# EAGLE design untitled (EAGLE 5.11)
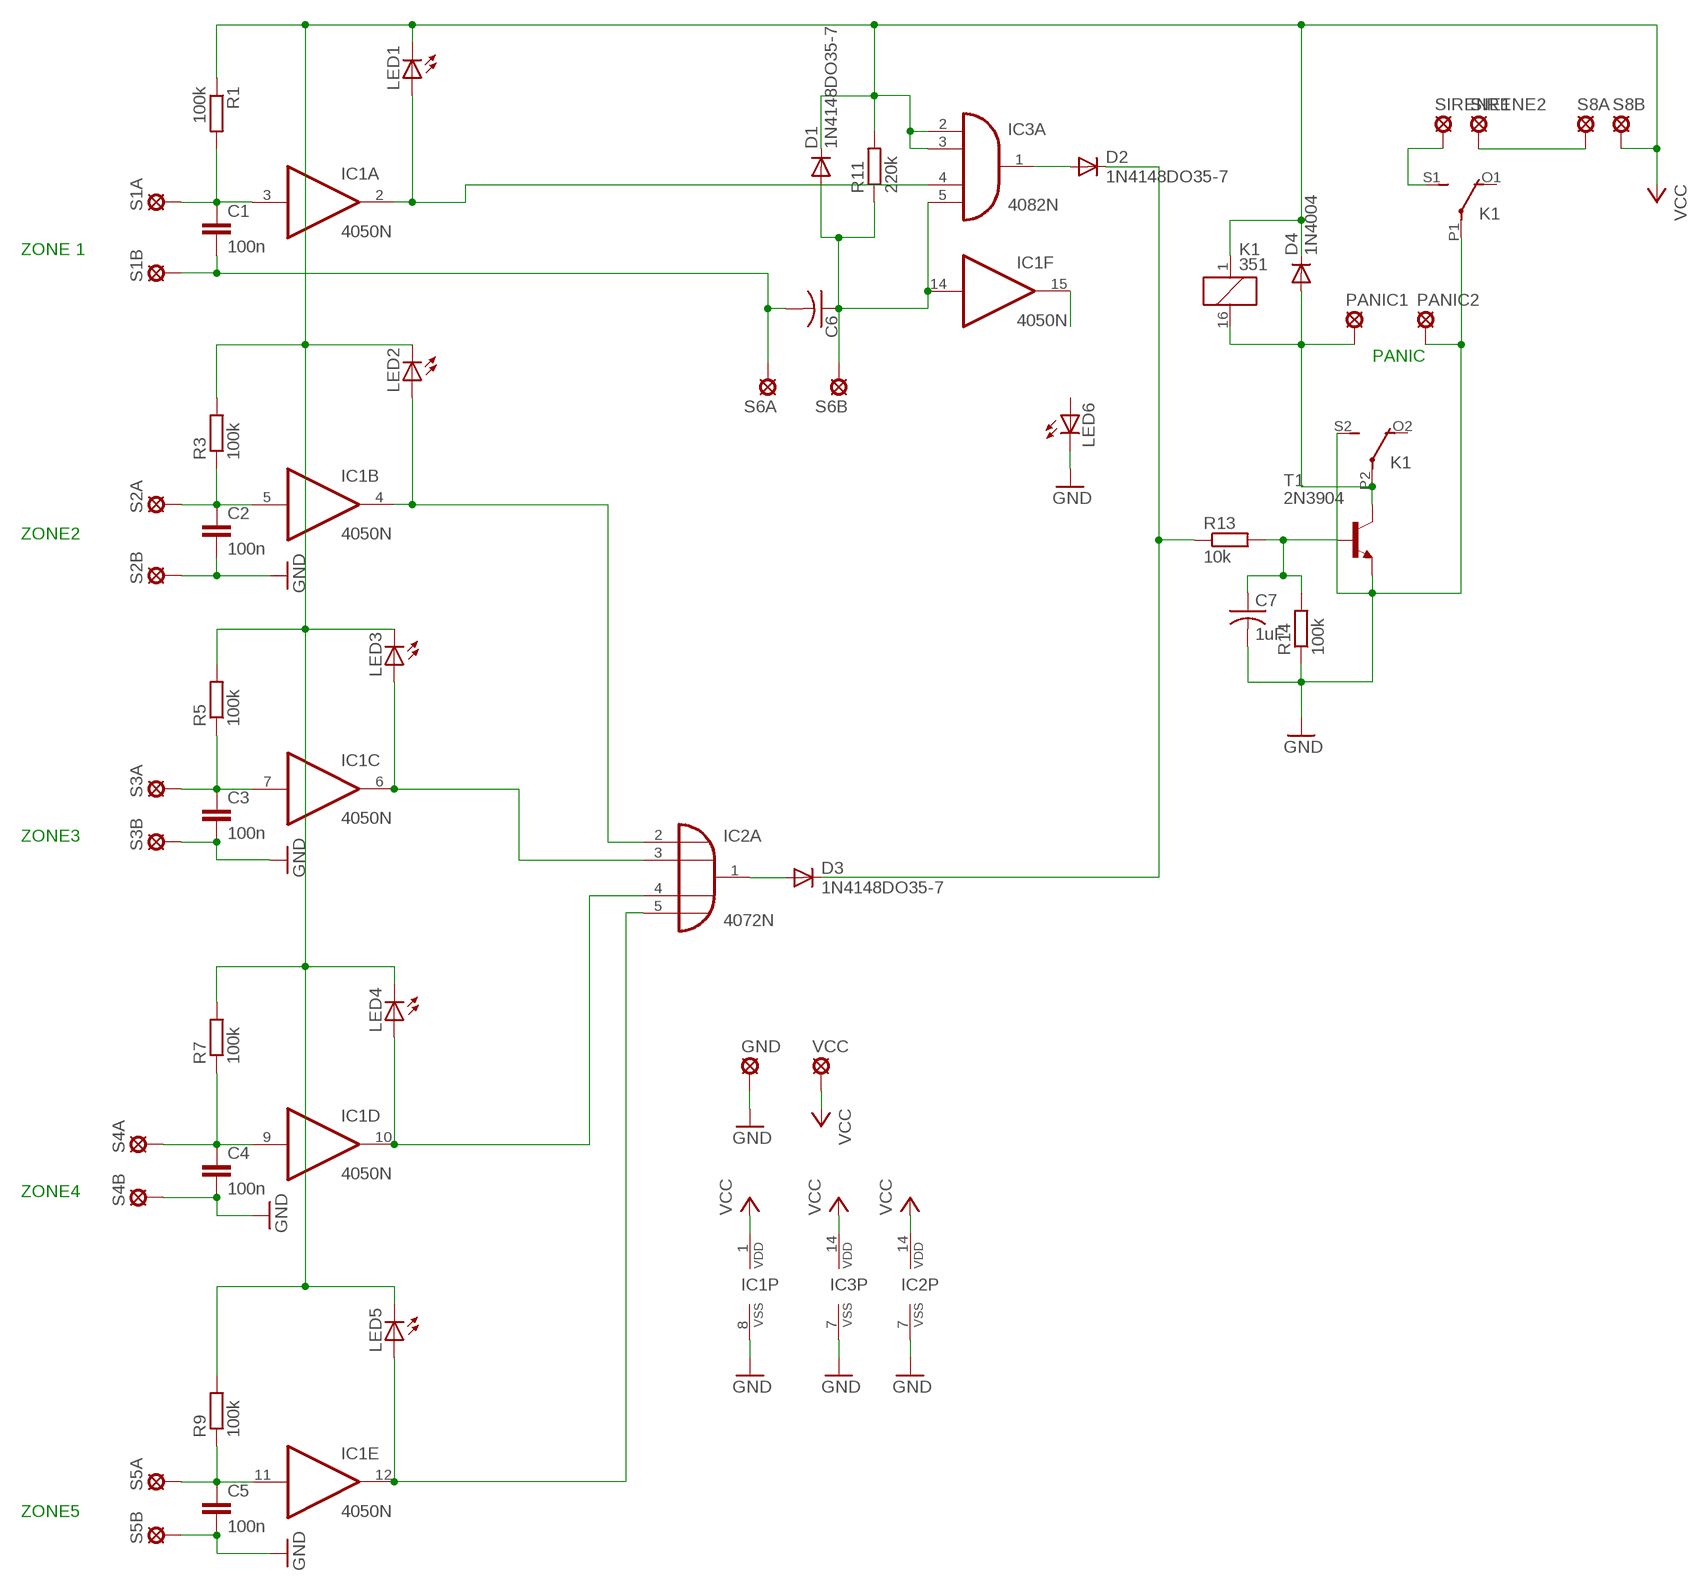
[diagram p0: schematic, sheet 1]

## Parts
C1  100n  C-EU025-024X044  [C025-024X044]
C2  100n  C-EU025-024X044  [C025-024X044]
C3  100n  C-EU025-024X044  [C025-024X044]
C4  100n  C-EU025-024X044  [C025-024X044]
C5  100n  C-EU025-024X044  [C025-024X044]
C6  C-US025-024X044  [C025-024X044]
C7  1uF  C-US025-024X044  [C025-024X044]
D1  1N4148DO35-7  [DO35-7]
D2  1N4148DO35-7  [DO35-7]
D3  1N4148DO35-7  [DO35-7]
D4  1N4004  [DO41-10]
GND  LSP11  [LSP11]
IC1  4050N  [DIL16]
IC2  4072N  [DIL14]
IC3  4082N  [DIL14]
K1  351  [351]
LED1  LED5MM  [LED5MM]
LED2  LED5MM  [LED5MM]
LED3  LED5MM  [LED5MM]
LED4  LED5MM  [LED5MM]
LED5  LED5MM  [LED5MM]
LED6  LED5MM  [LED5MM]
PANIC1  LSP11  [LSP11]
PANIC2  LSP11  [LSP11]
R1  100k  R-EU_0204/7  [0204/7]
R3  100k  R-EU_0204/7  [0204/7]
R5  100k  R-EU_0204/7  [0204/7]
R7  100k  R-EU_0204/7  [0204/7]
R9  100k  R-EU_0204/7  [0204/7]
R11  220k  R-EU_0204/7  [0204/7]
R13  10k  R-EU_0204/7  [0204/7]
R14  100k  R-EU_0204/7  [0204/7]
S1A  LSP11  [LSP11]
S1B  LSP11  [LSP11]
S2A  LSP11  [LSP11]
S2B  LSP11  [LSP11]
S3A  LSP11  [LSP11]
S3B  LSP11  [LSP11]
S4A  LSP11  [LSP11]
S4B  LSP11  [LSP11]
S5A  LSP11  [LSP11]
S5B  LSP11  [LSP11]
S6A  LSP11  [LSP11]
S6B  LSP11  [LSP11]
S8A  LSP11  [LSP11]
S8B  LSP11  [LSP11]
SIRENE1  LSP11  [LSP11]
SIRENE2  LSP11  [LSP11]
T1  2N3904  [TO92]
VCC  LSP11  [LSP11]

## Nets
GND: C2.2 C3.2 C4.2 C5.2 C7.2 GND.MP IC1.8(P:VSS) IC2.7(P:VSS) IC3.7(P:VSS) K1.P1(2:P) K1.S2(3:S) LED6.K(C) PANIC2.MP R14.1 S2B.MP S3B.MP S4B.MP S5B.MP T1.3(E)
N$1: C1.1 IC1.3(A:I) R1.2 S1A.MP
N$2: D2.A IC3.1(A:O)
N$4: IC1.2(A:O) IC3.4(A:I2) LED1.A
N$6: C2.1 IC1.5(B:I) R3.1 S2A.MP
N$7: C6.1 D1.A IC1.14(F:I) IC3.5(A:I3) R11.1 S6B.MP
N$9: IC1.4(B:O) IC2.2(A:I0) LED2.A
N$10: R13.2 T1.2(B)
N$11: C3.1 IC1.7(C:I) R5.1 S3A.MP
N$13: IC1.6(C:O) IC2.3(A:I1) LED3.A
N$14: D3.A IC2.1(A:O)
N$15: C4.1 IC1.9(D:I) R7.1 S4A.MP
N$16: D2.C D3.C R13.1
N$17: IC1.10(D:O) IC2.4(A:I2) LED4.A
N$19: K1.S1(2:S) SIRENE1.MP
N$20: C5.1 IC1.11(E:I) R9.1 S5A.MP
N$21: S8A.MP SIRENE2.MP
N$22: C7.1 R14.2
N$23: IC1.12(E:O) IC2.5(A:I3) LED5.A
N$26: IC1.15(F:O)
N$27: C1.2 C6.2 S1B.MP S6A.MP
N$28: D4.A K1.16 K1.P2(3:P) PANIC1.MP T1.1(C)
VCC: D1.C D4.C IC1.1(P:VDD) IC2.14(P:VDD) IC3.2(A:I0) IC3.3(A:I1) IC3.14(P:VDD) K1.1 LED1.K(C) LED2.K(C) LED3.K(C) LED4.K(C) LED5.K(C) R1.1 R3.2 R5.2 R7.2 R9.2 R11.2 S8B.MP VCC.MP
Unconnected: IC2.9(B:I0) IC2.10(B:I1) IC2.11(B:I2) IC2.12(B:I3) IC2.13(B:O) IC3.9(B:I0) IC3.10(B:I1) IC3.11(B:I2) IC3.12(B:I3) IC3.13(B:O) K1.O1(2:O) K1.O2(3:O) LED6.A

## Notes on the sheet
- ZONE 1
- PANIC
- ZONE2
- ZONE3
- ZONE4
- ZONE5

## Library data of the parts
C1-C5 = rcl:C-EU: CAPACITOR, European symbol
C6 C7 = rcl:C-US: CAPACITOR, American symbol
D1-D3 = diode:1N4148: DIODE high speed (Philips)
D4 = diode:1N4004: DIODE general purpose rectifier, 1 A
GND PANIC1 PANIC2 S1A S1B S2A S2B S3A S3B S4A S4B S5A S5B S6A S6B S8A S8B SIRENE1 SIRENE2 VCC = solpad:LSP11: SOLDER PAD drill 1.1 mm
IC1 = 40xx:4050: Hex non-inverting BUFFER
IC2 = 40xx:4072: Dual 4-input OR
IC3 = 40xx:4082: Dual 4-input AND
K1 = relay:351: RELAY 2 x switch, Omron; OC_FARNELL: unknown; OC_NEWARK: unknown
LED1-LED6 = led:LED: LED OSRAM: - CHIPLED LG R971, LG N971, LY N971, LG Q971, LY Q971, LO R971, LY R971 LH N974, LH R974 LS Q976, LO Q976, LY Q976 LO Q996 - Hyper CHIPLED LW Q18S LB Q993, LB Q99A, LB R99A - SideLED LS A670, LO A670, LY A670, LG A670, LP A670 LB A673, LV A673, LT A673, LW A673 LH A674 LY A675 LS A676, LA A676, LO A676, LY A676, LW A676 LS A679, LY A679, LG A679 - Hyper Micro SIDELED® LS Y876, LA Y876, LO Y876, LY Y876 LT Y87S - SmartLED LW L88C, LW L88S LB L89C, LB L89S, LG L890 LS L89K, LO L89K, LY L89K LS L896, LA L896, LO L896, LY L896 - TOPLED LS T670, LO T670, LY T670, LG T670, LP T670 LSG T670, LSP T670, LSY T670, LOP T670, LYG T670 LG T671, LOG T671, LSG T671 LB T673, LV T673, LT T673, LW T673 LH T674 LS T676, LA T676, LO T676, LY T676, LB T676, LH T676, LSB T676, LW T676 LB T67C, LV T67C, LT T67C, LS T67K, LO T67K, LY T67K, LW E67C LS E67B, LA E67B, LO E67B, LY E67B, LB E67C, LV E67C, LT E67C LW T67C LS T679, LY T679, LG T679 LS T770, LO T770, LY T770, LG T770, LP T770 LB T773, LV T773, LT T773, LW T773 LH T774 LS E675, LA E675, LY E675, LS T675 LS T776, LA T776, LO T776, LY T776, LB T776 LHGB T686 LT T68C, LB T68C - Hyper Mini TOPLED® LB M676 - Mini TOPLED Santana® LG M470 LS M47K, LO M47K, LY M47K Source: http://www.osram.convergy.de LUXEON: - LUMILED® LXK2-PW12-R00, LXK2-PW12-S00, LXK2-PW14-U00, LXK2-PW14-V00 LXK2-PM12-R00, LXK2-PM12-S00, LXK2-PM14-U00 LXK2-PE12-Q00, LXK2-PE12-R00, LXK2-PE12-S00, LXK2-PE14-T00, LXK2-PE14-U00 LXK2-PB12-K00, LXK2-PB12-L00, LXK2-PB12-M00, LXK2-PB14-N00, LXK2-PB14-P00, LXK2-PB14-Q00 LXK2-PR12-L00, LXK2-PR12-M00, LXK2-PR14-Q00, LXK2-PR14-R00 LXK2-PD12-Q00, LXK2-PD12-R00, LXK2-PD12-S00 LXK2-PH12-R00, LXK2-PH12-S00 LXK2-PL12-P00, LXK2-PL12-Q00, LXK2-PL12-R00 Source: www.luxeon.com KINGBRIGHT: KA-3528ASYC Source: www.kingbright.com
R1 R3 R5 R7 R9 R11 R13 R14 = rcl:R-EU_: RESISTOR, European symbol
T1 = transistor:2N3904: NPN TRANSISTOR

## Board
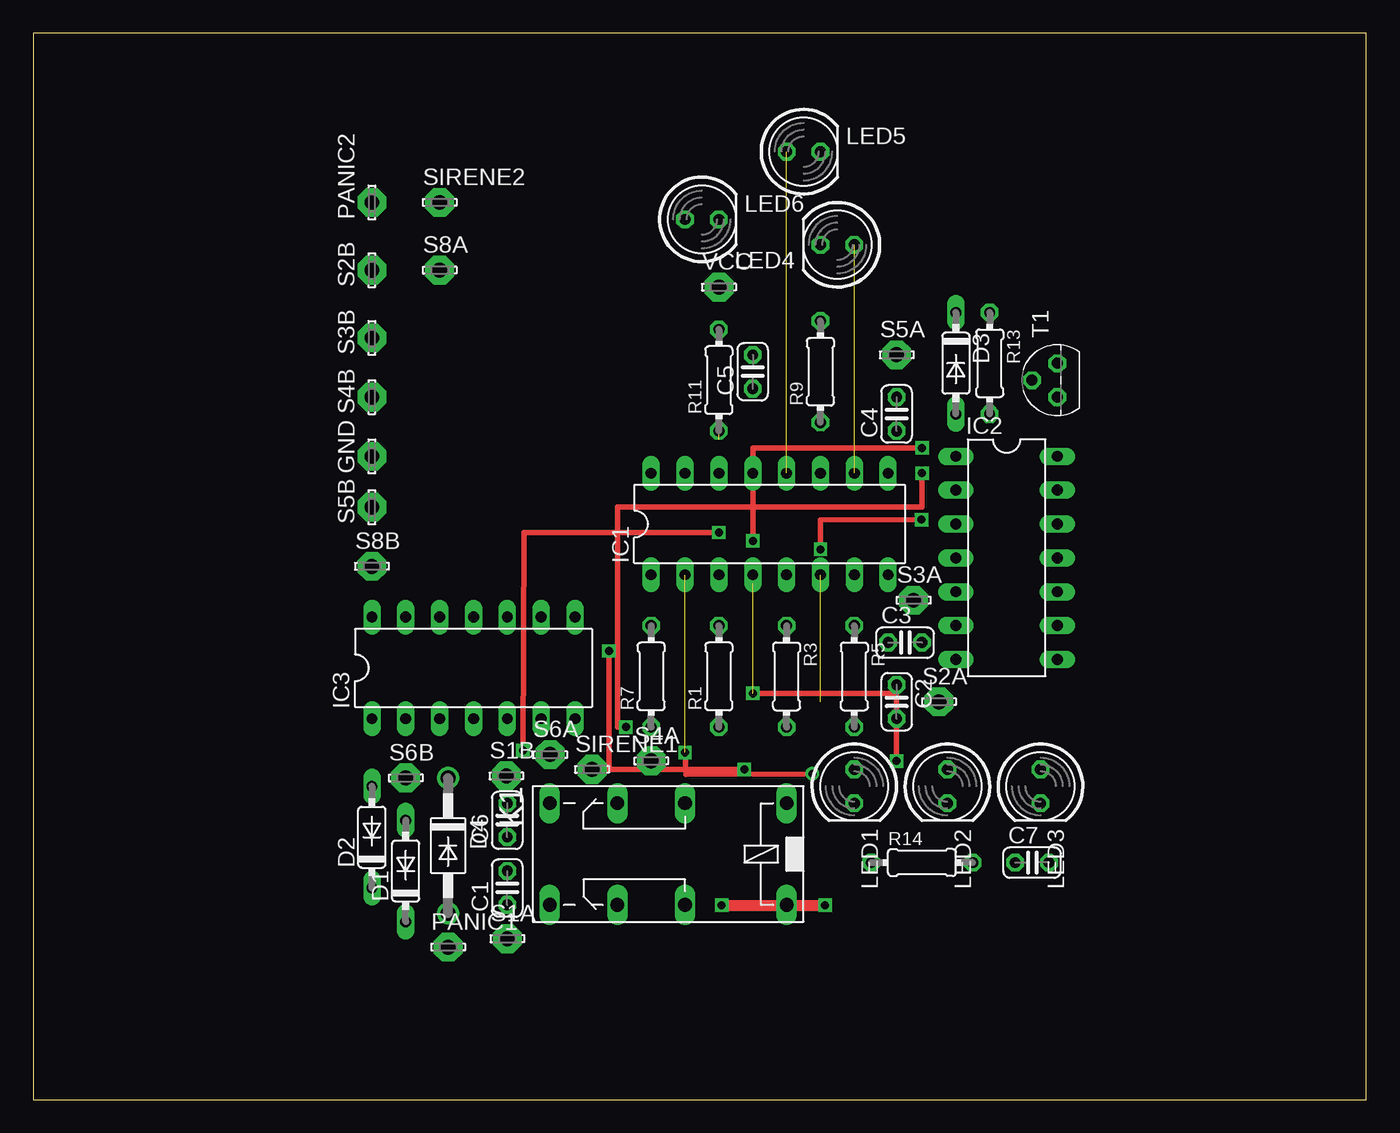
[diagram p1: board, top side]
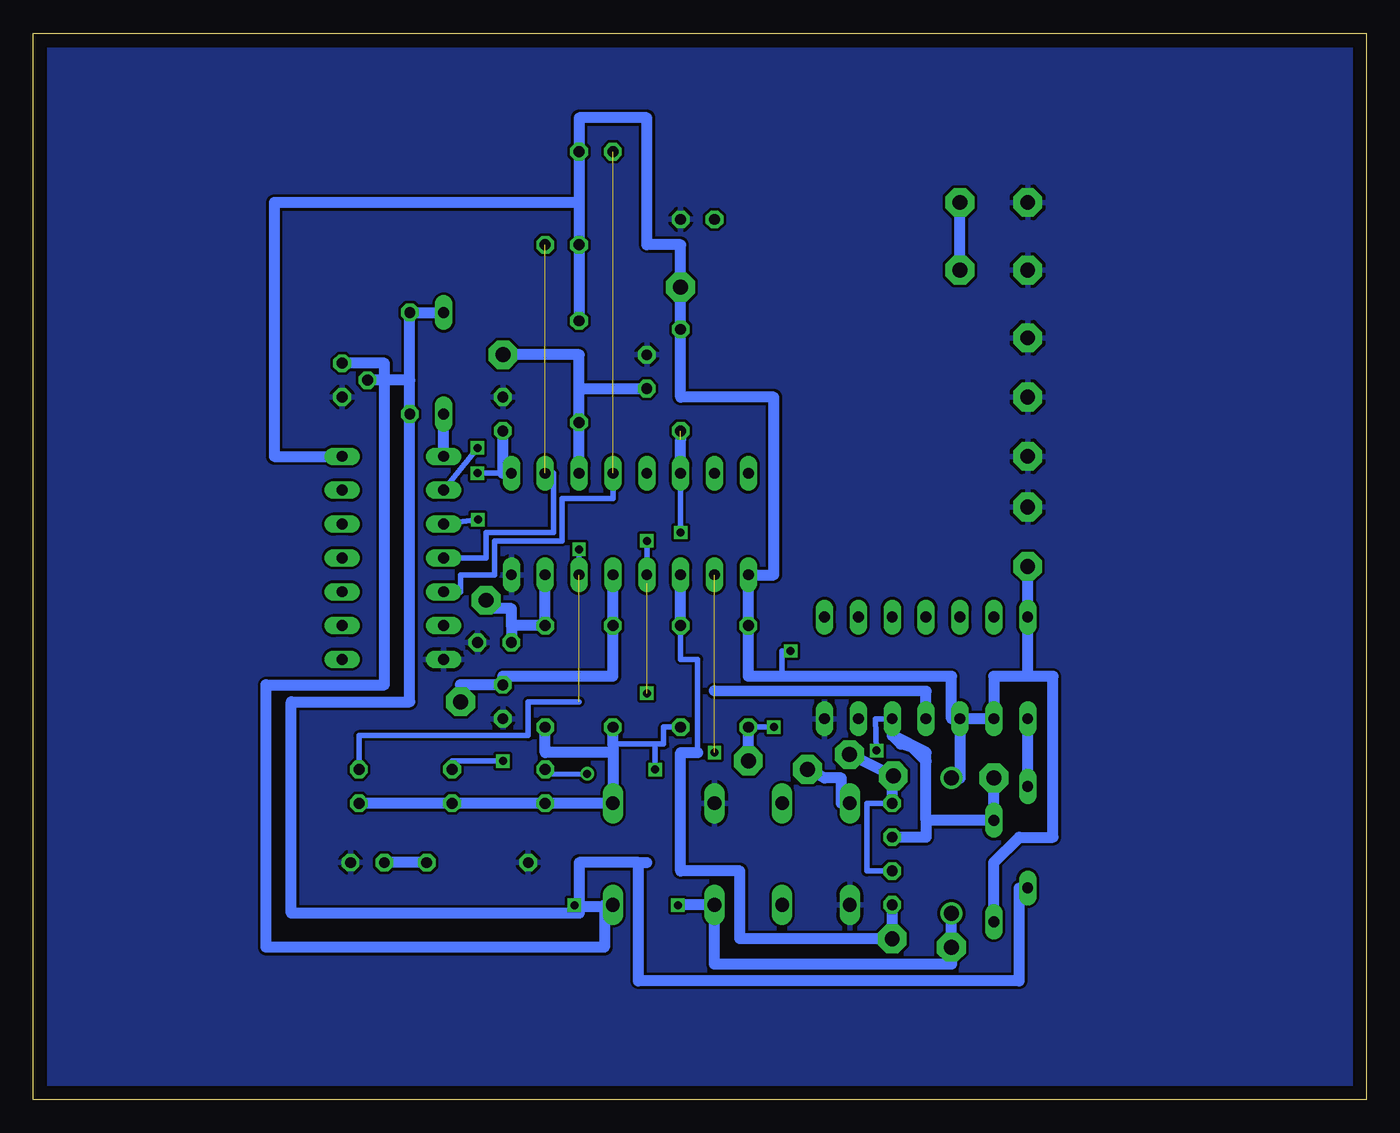
[diagram p2: board, bottom side, seen from below]

Size 100 x 80 mm. Coordinates in mm from the lower left corner, seen from the top.
Outline: 0,0 100,0 100,80 0,80 0,0
Copper layers (1*16): Top 0.035mm / dielectric 1.5mm / Bottom 0.035mm
Design rules "default": minimum track width 10mil, minimum drill 24mil, track to track 8mil, track to pad 8mil, pad to pad 8mil, via to via 8mil, smd to smd 8mil, copper to edge 40mil, drill to drill 8mil, minimum pad ring 10mil, minimum via ring 8mil, stop-mask expansion 4mil, vias tented up to drill 0mil, thermal gap 10mil

### Footprints (pad centres in the part's own frame; a part is rotated, then mirrored left to right if it is on the bottom)
C025-024X044 = drill 0.813 octagon: 1 -1.27,0; 2 1.27,0
DO35-7 = drill 0.813 long: A 3.81,0; C -3.81,0
DO41-10 = drill 1.118 round: A 5.08,0; C -5.08,0
LSP11 = drill 1.118 pad 2.159 octagon: MP 0,0
DIL16 = drill 0.813 long: 1 -8.89,-3.81; 2 -6.35,-3.81; 3 -3.81,-3.81; 4 -1.27,-3.81; 5 1.27,-3.81; 6 3.81,-3.81; 7 6.35,-3.81; 8 8.89,-3.81; 9 8.89,3.81; 10 6.35,3.81; 11 3.81,3.81; 12 1.27,3.81; 13 -1.27,3.81; 14 -3.81,3.81; 15 -6.35,3.81; 16 -8.89,3.81
DIL14 = drill 0.813 long: 1 -7.62,-3.81; 2 -5.08,-3.81; 3 -2.54,-3.81; 4 0,-3.81; 5 2.54,-3.81; 6 5.08,-3.81; 7 7.62,-3.81; 8 7.62,3.81; 9 5.08,3.81; 10 2.54,3.81; 11 0,3.81; 12 -2.54,3.81; 13 -5.08,3.81; 14 -7.62,3.81
351 = drill 1.016 long: 1 -3.81,-3.81; 16 -3.81,3.81; O1 8.89,-3.81; O2 8.89,3.81; P1 3.81,-3.81; P2 3.81,3.81; S1 13.97,-3.81; S2 13.97,3.81
LED5MM = drill 0.813 octagon: A -1.27,0; K 1.27,0
0204/7 = drill 0.813 octagon: 1 -3.81,0; 2 3.81,0
TO92 = drill 0.813 octagon: 1 1.27,0; 2 0,1.905; 3 -1.27,0

### Placement (x,y rotation side)
C1  35.56,15.88 90 top
C2  64.77,29.84 270 top
C3  65.41,34.29 0 top
C4  64.77,51.44 90 top
C5  53.98,54.61 90 top
C6  35.56,20.95 90 top
C7  74.93,17.78 0 top
D1  27.94,17.14 90 top
D2  25.4,19.68 90 top
D3  69.22,55.24 270 top
D4  31.11,19.05 270 top
GND  25.4,48.26 90 top
IC1  55.24,43.18 0 top
IC2  73.03,40.64 270 top
IC3  33.02,32.38 0 top
K1  52.7,18.41 180 top
LED1  61.59,23.5 270 top
LED2  68.58,23.5 270 top
LED3  75.56,23.5 270 top
LED4  60.33,64.14 180 top
LED5  57.78,71.12 0 top
LED6  50.16,66.04 0 top
PANIC1  31.11,11.43 0 top
PANIC2  25.4,67.31 90 top
R1  51.44,31.75 90 top
R3  56.52,31.75 270 top
R5  61.59,31.75 270 top
R7  46.35,31.75 90 top
R9  59.05,54.61 90 top
R11  51.44,53.98 90 top
R13  71.75,55.24 270 top
R14  66.67,17.78 0 top
S1A  35.56,12.06 0 top
S1B  35.48,24.28 0 top
S2A  67.94,29.84 0 top
S2B  25.4,62.23 90 top
S3A  66.04,37.47 0 top
S3B  25.4,57.15 90 top
S4A  46.35,25.4 0 top
S4B  25.4,52.7 90 top
S5A  64.77,55.88 0 top
S5B  25.4,44.45 90 top
S6A  38.76,25.88 0 top
S6B  27.94,24.13 0 top
S8A  30.48,62.23 0 top
S8B  25.4,40.01 0 top
SIRENE1  41.91,24.77 0 top
SIRENE2  30.48,67.31 0 top
T1  76.83,53.98 90 top
VCC  51.44,60.96 0 top

### Tracks (layer width: path | path; a pad name or v marks a point on that pad's centre or on a via)
GND
  pour Bottom: 0.64,78.74 99.06,78.74 99.06,0.64 0.64,0.64
N$1
  Bottom 0.406: 50.16,26.04 50.16,33.02 51.44,33.02 R1.2
  Bottom 0.813: R1.2 IC1.3 | C1.1 S1A.MP 46.99,12.06 46.99,17.14 51.44,17.14 51.44,26.04 50.16,26.04
N$2
  Bottom 0.813: D2.A IC3.1
N$4  (via drill 0.6)  (2 unrouted)
  Top 0.406: v58.45,24.43 48.97,24.38 v48.9,26.04
  Bottom 0.406: LED1.A 61.59,24.41 v58.45,24.43
  Bottom 0.813: IC3.4 33.02,30.63 48.9,30.66
N$6
  Bottom 0.813: IC1.5 R3.1 56.52,31.75 64.77,31.75 C2.1 67.94,31.11 S2A.MP
N$7  (via drill 0.6)  (1 unrouted)
  Top 0.406: v36.73,26.19 36.83,42.55 v51.44,42.55
  Bottom 0.406: IC3.5 36.83,28.57 v36.73,26.19 | v51.44,42.55 IC1.14
  Bottom 0.813: IC1.14 51.44,49.53 | 33.02,20.95 33.02,19.68 C6.1 | 33.02,26.04 34.92,26.67 | 33.02,20.95 33.02,25.4 | 34.92,26.67 34.29,26.67 33.02,25.4 | 34.92,26.67 35.56,27.3 | 35.56,27.3 IC3.5 | 33.02,26.04 35.56,27.3 | 33.02,25.4 33.02,26.04 | 33.02,20.95 D1.A S6B.MP
N$9  (via drill 0.6)  (1 unrouted)
  Top 0.406: v53.98,30.48 64.77,30.48 v64.77,25.4 | v66.67,48.9 53.98,48.9 v53.98,41.91
  Bottom 0.406: v64.77,25.4 68.58,25.4 LED2.A | v66.67,48.9 IC2.2 | 53.98,38.73 v53.98,41.91
  Bottom 0.813: IC1.4 53.98,38.73
N$10
  Bottom 0.813: R13.2 71.75,53.98 T1.2
N$11
  Bottom 0.813: IC1.7 R5.1 64.14,35.56 | 64.14,35.56 C3.1 | 64.14,35.56 64.14,36.83 66.04,36.83 S3A.MP
N$13  (via drill 0.6)  (1 unrouted)
  Top 0.406: v59.05,41.27 59.05,43.48 v66.65,43.51
  Bottom 0.406: LED3.A 75.56,27.3 62.87,27.3 62.87,29.84 59.05,29.84 | IC1.6 v59.05,41.27 | v66.65,43.51 IC2.3
N$14
  Bottom 0.813: IC2.1 D3.A
N$15  (via drill 0.6)
  Top 0.406: v44.45,27.94 43.81,27.94 43.81,44.45 66.67,44.45 v66.67,46.99
  Bottom 0.406: R7.1 v44.45,27.94 | v66.67,46.99 64.77,46.99
  Bottom 0.813: IC1.9 64.77,46.99 C4.1 | S4A.MP R7.1
N$16
  Bottom 0.813: D3.C R13.1 71.75,29.84 80.64,29.84 80.64,13.97 59.05,13.97 59.05,17.78 54.61,17.78 | D2.C 26.04,15.88 26.04,8.89 54.61,8.89 54.61,17.78 | 54.61,17.78 53.98,17.78
N$17  (1 unrouted)
  Bottom 0.406: IC1.10 60.96,46.99 60.96,42.55 66.04,42.55 66.04,40.64 IC2.4
N$19
  Bottom 0.813: K1.S1 39.37,22.23 39.37,24.13 40.64,24.13 SIRENE1.MP
N$20
  Bottom 0.813: IC1.11 R9.1 59.05,53.34 | 59.05,53.34 C5.1 | 59.05,53.34 59.05,55.88 S5A.MP
N$21
  Bottom 0.813: S8A.MP SIRENE2.MP
N$22
  Bottom 0.813: R14.2 C7.1
N$23  (1 unrouted)
  Bottom 0.406: IC2.5 67.94,38.1 67.94,39.37 65.41,39.37 65.41,41.91 60.33,41.91 60.33,45.09 56.52,45.09 IC1.12
N$27
  Bottom 0.406: C1.2 37.47,17.14 37.47,22.23 C6.2
  Bottom 0.813: S6A.MP S1B.MP 35.56,24.08 C6.2
N$28  (via drill 0.6)
  Top 0.813: v51.64,14.58 v59.41,14.58
  Bottom 0.406: 31.11,13.34 D4.A
  Bottom 0.813: 31.11,13.34 PANIC1.MP 31.11,10.16 48.9,10.16 K1.P2 51.64,14.61 v51.64,14.58 | T1.1 73.66,55.24 73.66,31.11 82.55,31.11 82.55,11.43 57.15,11.43 57.15,14.5 | K1.16 57.15,14.61 57.15,14.5 | v59.41,14.58 59.41,14.5 57.15,14.5
VCC  (via drill 0.6)
  Top 0.406: v53.34,24.77 43.18,24.77 v43.18,33.66
  Bottom 0.406: 53.34,26.67 56.52,26.67 | R1.1 52.7,27.94 52.7,26.67 53.34,26.67 | v53.34,24.77 53.34,26.67 | v43.18,33.66 43.81,33.66 43.81,31.75
  Bottom 0.813: S8B.MP IC3.14 25.4,31.75 | 59.05,67.31 LED5.K 59.05,73.66 53.98,73.66 53.98,64.14 51.44,64.14 R11.2 | 59.05,67.31 LED4.K R9.2 | R11.2 VCC.MP | 25.4,31.75 27.94,31.75 IC3.2 IC3.3 | IC3.3 30.48,24.13 D4.C | 59.05,67.31 81.92,67.31 81.92,48.26 IC2.14 | LED3.K LED2.K LED1.K K1.1 56.52,26.04 | 56.52,26.04 56.52,26.67 R3.2 | R5.2 61.59,26.04 56.52,26.04 | 25.4,31.75 23.5,31.75 23.5,19.68 26.04,19.68 27.94,17.78 D1.C | IC3.3 31.11,28.57 31.11,31.75 43.81,31.75 46.35,31.75 R7.2 IC1.1 44.45,39.37 44.45,52.7 51.44,52.7 R11.2